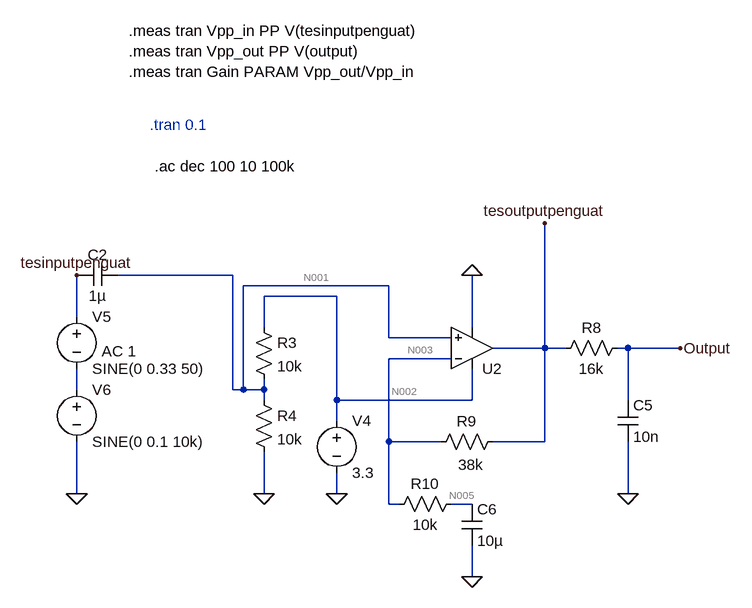
[diagram p0: schematic Kalibrasi Pengondisian Sinyal (Penyaring Anti-Aliasing).asc]
Kalibrasi Pengondisian Sinyal (Penyaring Anti-Aliasing).asc, the LTspice schematic file:
Version 4
SHEET 1 880 1428
WIRE -192 848 -368 848
WIRE 48 864 -176 864
WIRE -32 880 -144 880
WIRE -432 912 -432 848
WIRE -144 928 -144 880
WIRE 176 928 176 848
WIRE 48 944 48 864
WIRE 144 944 48 944
WIRE 288 960 288 768
WIRE 288 960 208 960
WIRE 320 960 288 960
WIRE 416 960 400 960
WIRE 496 960 416 960
WIRE 144 976 48 976
WIRE -432 1024 -432 992
WIRE -192 1024 -192 848
WIRE -176 1024 -176 864
WIRE -176 1024 -192 1024
WIRE -144 1024 -144 1008
WIRE -144 1024 -176 1024
WIRE -144 1040 -144 1024
WIRE -32 1040 -32 880
WIRE 176 1040 176 992
WIRE 176 1040 -32 1040
WIRE 416 1040 416 960
WIRE -32 1072 -32 1040
WIRE 48 1104 48 976
WIRE 128 1104 48 1104
WIRE 288 1104 288 960
WIRE 288 1104 208 1104
WIRE -432 1184 -432 1104
WIRE -144 1184 -144 1120
WIRE -32 1184 -32 1152
WIRE 416 1184 416 1104
WIRE 48 1200 48 1104
WIRE 64 1200 48 1200
WIRE 176 1200 144 1200
WIRE 176 1312 176 1264
FLAG 496 960 Output
FLAG 416 1184 0
FLAG 288 768 tesoutputpenguat
FLAG -432 848 tesinputpenguat
FLAG 176 848 0
FLAG 176 1312 0
FLAG -432 1184 0
FLAG -144 1184 0
FLAG -32 1184 0
SYMBOL voltage -32 1056 R0
SYMATTR InstName V4
SYMATTR Value 3.3
SYMBOL res -160 912 R0
SYMATTR InstName R3
SYMATTR Value 10k
SYMBOL res -160 1024 R0
SYMATTR InstName R4
SYMATTR Value 10k
SYMBOL voltage -432 896 R0
WINDOW 123 38 69 Left 2
WINDOW 39 0 0 Left 0
SYMATTR InstName V5
SYMATTR Value SINE(0 0.33 50)
SYMATTR Value2 AC 1
SYMBOL voltage -432 1008 R0
WINDOW 123 0 0 Left 0
WINDOW 39 0 0 Left 0
SYMATTR InstName V6
SYMATTR Value SINE(0 0.1 10k)
SYMBOL cap -368 832 R90
WINDOW 0 0 32 VBottom 2
WINDOW 3 32 32 VTop 2
SYMATTR InstName C2
SYMATTR Value 1µ
SYMBOL res 416 944 R90
WINDOW 0 0 56 VBottom 2
WINDOW 3 32 56 VTop 2
SYMATTR InstName R8
SYMATTR Value 16k
SYMBOL cap 400 1040 R0
SYMATTR InstName C5
SYMATTR Value 10n
SYMBOL OpAmps\\UniversalOpAmp2 176 960 M180
SYMATTR InstName U2
SYMBOL res 224 1088 R90
WINDOW 0 0 56 VBottom 2
WINDOW 3 36 50 VTop 2
SYMATTR InstName R9
SYMATTR Value 38k
SYMBOL res 160 1184 R90
WINDOW 0 0 56 VBottom 2
WINDOW 3 32 56 VTop 2
SYMATTR InstName R10
SYMATTR Value 10k
SYMBOL cap 160 1200 R0
SYMATTR InstName C6
SYMATTR Value 10µ
TEXT -320 616 Left 2 ;.tran 0.1
TEXT -312 680 Left 2 !.ac dec 100 10 100k
TEXT -352 472 Left 2 !.meas tran Vpp_in PP V(tesinputpenguat)\n.meas tran Vpp_out PP V(output)\n.meas tran Gain PARAM Vpp_out/Vpp_in

The netlist it stands for:
* Kalibrasi Pengondisian Sinyal (Penyaring Anti-Aliasing).asc
V4 N002 0 3.3
R3 N002 N001 10k
R4 N001 0 10k
V5 tesinputpenguat N004 SINE(0 0.33 50) AC 1
V6 N004 0 SINE(0 0.1 10k)
C2 N001 tesinputpenguat 1µ
R8 Output tesoutputpenguat 16k
C5 Output 0 10n
XU2 N001 N003 N002 0 tesoutputpenguat level2 Avol=1Meg GBW=10Meg Slew=10Meg Ilimit=25m Rail=0 Vos=0 En=0 Enk=0 In=0 Ink=0 Rin=500Meg  ; pins In+ In- V+ V- OUT
R9 tesoutputpenguat N003 38k
R10 N005 N003 10k
C6 N005 0 10µ
* .tran 0.1
.ac dec 100 10 100k
.meas tran Vpp_in PP V(tesinputpenguat)
.meas tran Vpp_out PP V(output)
.meas tran Gain PARAM Vpp_out/Vpp_in
.lib UniversalOpAmp2.lib
.backanno
.end

* Results of the author's LTspice run, read from the files saved beside the schematic
* Operating Point, zero values left out:
*   V(n002) = 3.3 V
*   V(n001) = 1.65 V
*   V(output) = 1.65 V
*   V(tesoutputpenguat) = 1.65 V
*   V(n003) = 1.65 V
*   V(n005) = 1.65 V
*   I(R3) = 165 µA
*   I(R4) = 165 µA
*   I(V4) = -330 µA
*   Ix(u2:3) = 165 µA
*   Ix(u2:4) = -165 µA
*   Ix(u2:5) = 37.17 pA
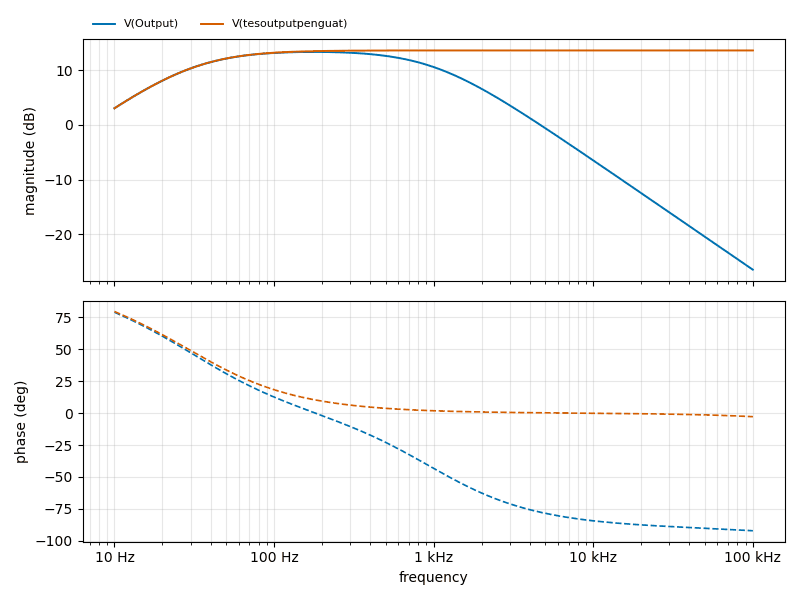
[diagram p1: AC Analysis of Kalibrasi Pengondisian Sinyal (Penyaring Anti-Aliasing).asc, plotted from the saved traces]
* AC Analysis, 1 run:
*   V(Output): 3.05 dB at 10 Hz, -26.43 dB at 100 kHz, peak 13.35 dB at 177.8 Hz, 3 dB below the peak at 30.04 Hz and 1.057 kHz
*   V(tesoutputpenguat): 3.06 dB at 10 Hz, 13.61 dB at 100 kHz, peak 13.62 dB at 8.128 kHz, 3 dB below the peak at 31.91 Hz